# EAGLE schematic filter-prototype (EAGLE 8.6.0)
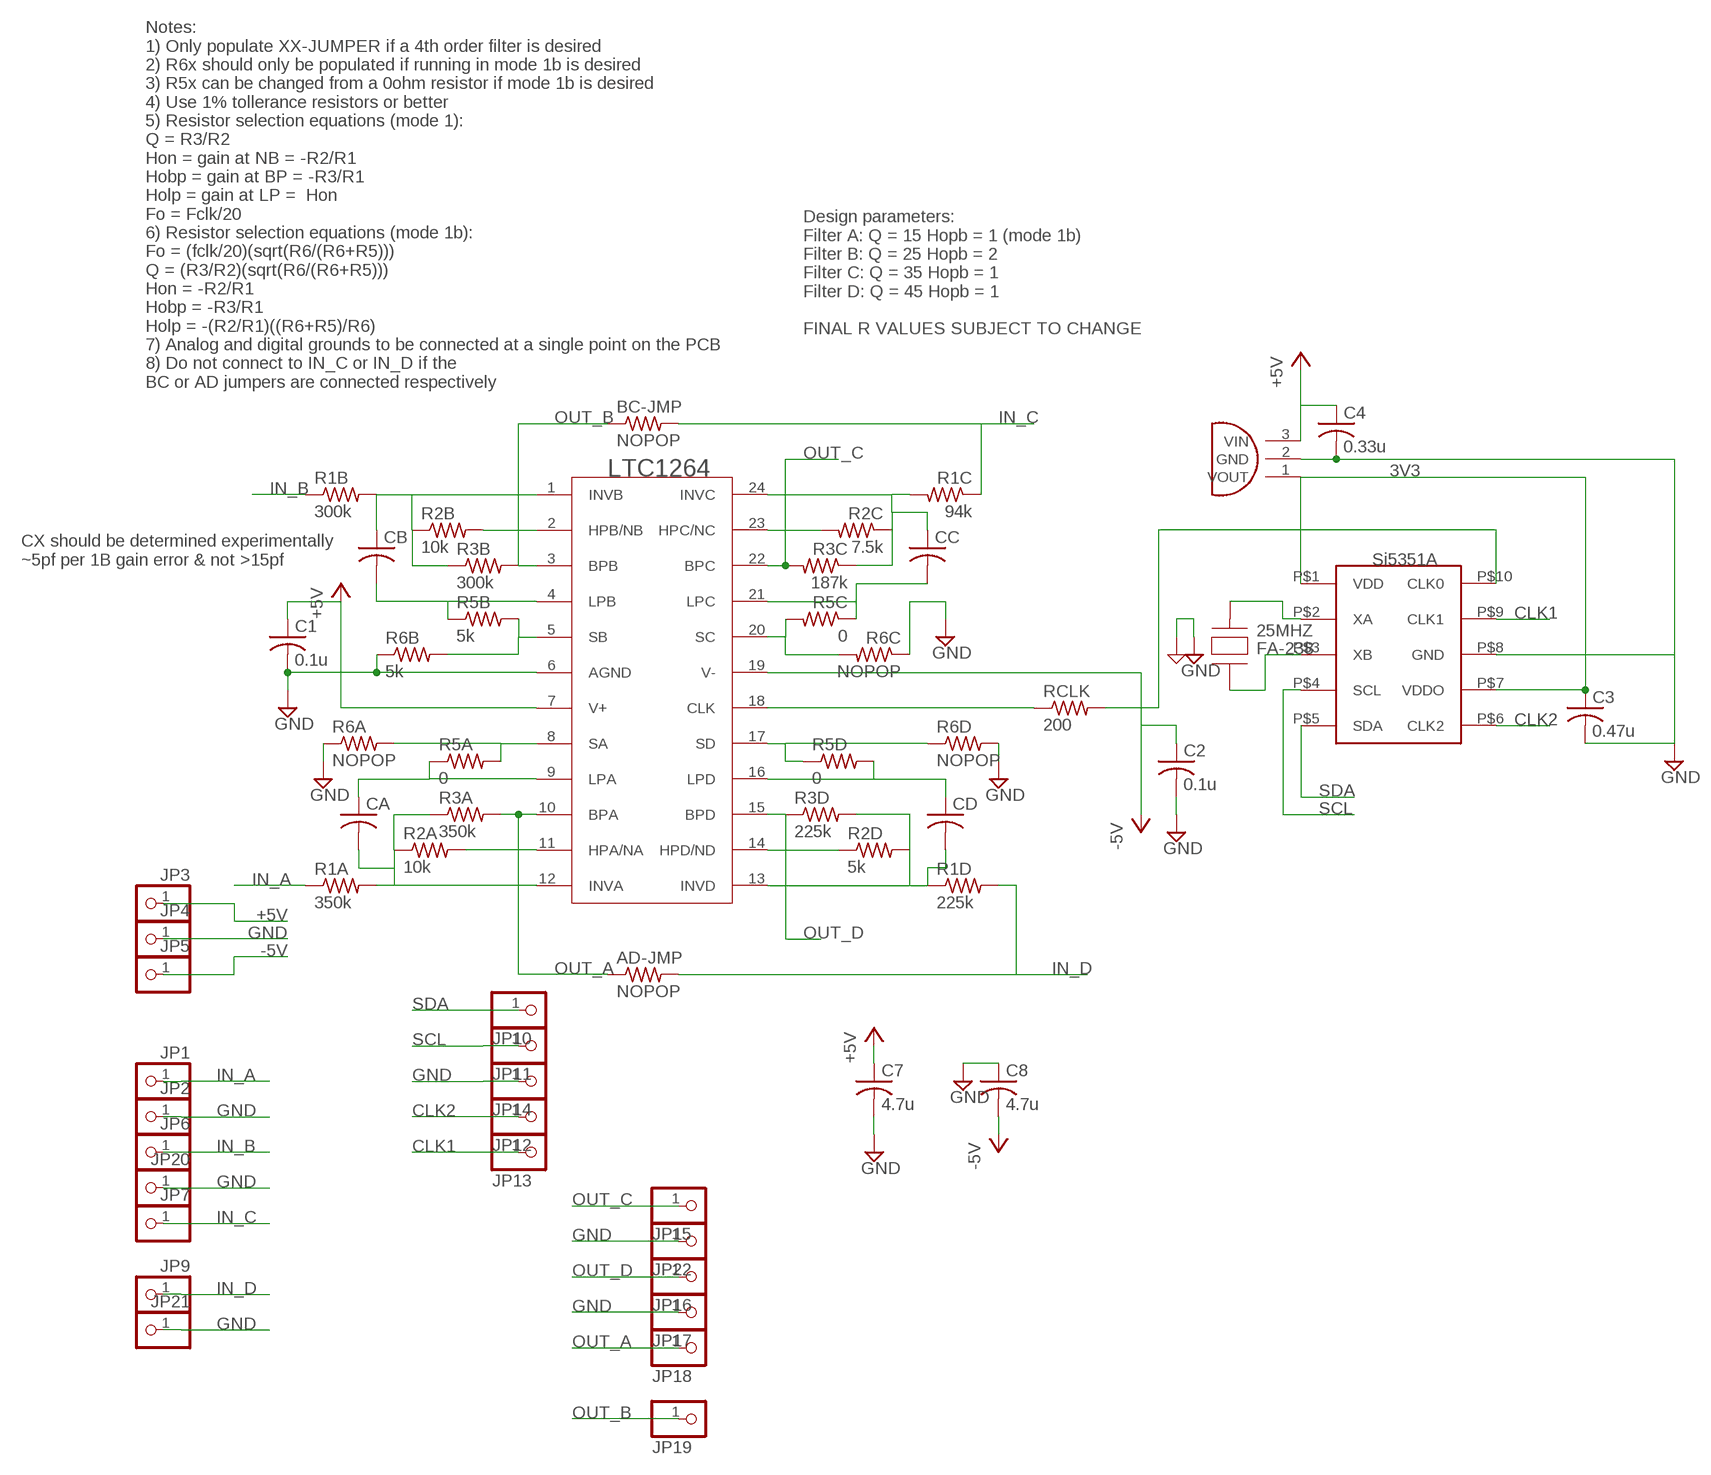
[diagram p0: schematic, sheet 1]

## Parts
25MHZ  FA-238  [FA-238]
AD-JMP  NOPOP  R-US_R0805  [R0805]
BC-JMP  NOPOP  R-US_R0805  [R0805]
C1  0.1u  C-USC0805  [C0805]
C2  0.1u  C-USC0805  [C0805]
C3  0.47u  C-USC0805  [C0805]
C4  0.33u  C-USC0805  [C0805]
C7  4.7u  C-USC0805  [C0805]
C8  4.7u  C-USC0805  [C0805]
CA  C-USC0805  [C0805]
CB  C-USC0805  [C0805]
CC  C-USC0805  [C0805]
CD  C-USC0805  [C0805]
JP1  PINHD-1X1  [1X01]
JP2  PINHD-1X1  [1X01]
JP3  PINHD-1X1  [1X01]
JP4  PINHD-1X1  [1X01]
JP5  PINHD-1X1  [1X01]
JP6  PINHD-1X1  [1X01]
JP7  PINHD-1X1  [1X01]
JP9  PINHD-1X1  [1X01]
JP10  PINHD-1X1  [1X01]
JP11  PINHD-1X1  [1X01]
JP12  PINHD-1X1  [1X01]
JP13  PINHD-1X1  [1X01]
JP14  PINHD-1X1  [1X01]
JP15  PINHD-1X1  [1X01]
JP16  PINHD-1X1  [1X01]
JP17  PINHD-1X1  [1X01]
JP18  PINHD-1X1  [1X01]
JP19  PINHD-1X1  [1X01]
JP20  PINHD-1X1  [1X01]
JP21  PINHD-1X1  [1X01]
JP22  PINHD-1X1  [1X01]
R1A  350k  R-US_R0805  [R0805]
R1B  300k  R-US_R0805  [R0805]
R1C  94k  R-US_R0805  [R0805]
R1D  225k  R-US_R0805  [R0805]
R2A  10k  R-US_R0805  [R0805]
R2B  10k  R-US_R0805  [R0805]
R2C  7.5k  R-US_R0805  [R0805]
R2D  5k  R-US_R0805  [R0805]
R3A  350k  R-US_R0805  [R0805]
R3B  300k  R-US_R0805  [R0805]
R3C  187k  R-US_R0805  [R0805]
R3D  225k  R-US_R0805  [R0805]
R5A  0  R-US_R0805  [R0805]
R5B  5k  R-US_R0805  [R0805]
R5C  0  R-US_R0805  [R0805]
R5D  0  R-US_R0805  [R0805]
R6A  NOPOP  R-US_R0805  [R0805]
R6B  5k  R-US_R0805  [R0805]
R6C  NOPOP  R-US_R0805  [R0805]
R6D  NOPOP  R-US_R0805  [R0805]
RCLK  200  R-US_R0805  [R0805]
U$1  LTC1264SMD  [SO24W]
U$2  SI5351A  [MSOP-10]
U$3  L78L33ACZ  [TO-92]

## Nets
3V3: C3.1 U$2.P$1(VDD) U$2.P$7(VDDO) U$3.1(VOUT)
+5V: C1.1 C4.1 C7.1 JP3.1 U$1.7(V+) U$3.3(VIN)
-5V: C2.1 C8.2 JP5.1 U$1.19(V-)
CLK1: JP13.1 U$2.P$9(CLK1)
CLK2: JP12.1 U$2.P$6(CLK2)
GND: 25MHZ.P$1(GND) 25MHZ.P$3(GND) C1.2 C2.2 C3.2 C4.2 C7.2 C8.1 JP2.1 JP4.1 JP14.1 JP17.1 JP20.1 JP21.1 JP22.1 R6A.1 R6B.1 R6C.1 R6D.2 U$1.6(AGND) U$2.P$8(GND) U$3.2(GND)
IN_A: JP1.1 R1A.1
IN_B: JP6.1 R1B.1
IN_C: BC-JMP.2 JP7.1 R1C.1
IN_D: AD-JMP.2 JP9.1 R1D.2
N$2: R2B.2 U$1.2(HPB/NB)
N$3: RCLK.2 U$2.P$10(CLK0)
N$4: R2C.2 U$1.23(HPC/NC)
N$7: CB.2 R5B.1 U$1.4(LPB)
N$8: R5B.2 R6B.2 U$1.5(SB)
N$12: CC.2 R5C.1 U$1.21(LPC)
N$13: R5C.2 R6C.2 U$1.20(SC)
N$16: R2A.2 U$1.11(HPA/NA)
N$18: CA.1 R5A.1 U$1.9(LPA)
N$19: R5A.2 R6A.2 U$1.8(SA)
N$20: CB.1 R1B.2 R2B.1 R3B.1 U$1.1(INVB)
N$21: CC.1 R1C.2 R2C.1 R3C.1 U$1.24(INVC)
N$22: R5D.1 R6D.1 U$1.17(SD)
N$23: CD.1 R5D.2 U$1.16(LPD)
N$25: R2D.1 U$1.14(HPD/ND)
N$26: CD.2 R1D.1 R2D.2 R3D.2 U$1.13(INVD)
N$27: 25MHZ.P$4(XA) U$2.P$2(XA)
N$28: 25MHZ.P$2(XB) U$2.P$3(XB)
N$31: RCLK.1 U$1.18(CLK)
N$32: CA.2 R1A.2 R2A.1 R3A.1 U$1.12(INVA)
OUT_A: AD-JMP.1 JP18.1 R3A.2 U$1.10(BPA)
OUT_B: BC-JMP.1 JP19.1 R3B.2 U$1.3(BPB)
OUT_C: JP15.1 R3C.2 U$1.22(BPC)
OUT_D: JP16.1 R3D.1 U$1.15(BPD)
SCL: JP11.1 U$2.P$4(SCL)
SDA: JP10.1 U$2.P$5(SDA)

## Notes on the sheet
- Design parameters:
  Filter A: Q = 15 Hopb = 1 (mode 1b)
  Filter B: Q = 25 Hopb = 2
  Filter C: Q = 35 Hopb = 1
  Filter D: Q = 45 Hopb = 1
  
  FINAL R VALUES SUBJECT TO CHANGE
- Notes: 
  1) Only populate XX-JUMPER if a 4th order filter is desired
  2) R6x should only be populated if running in mode 1b is desired
  3) R5x can be changed from a 0ohm resistor if mode 1b is desired
  4) Use 1% tollerance resistors or better
  5) Resistor selection equations (mode 1):
  Q = R3/R2
  Hon = gain at NB = -R2/R1
  Hobp = gain at BP = -R3/R1
  Holp = gain at LP =  Hon
  Fo = Fclk/20
  6) Resistor selection equations (mode 1b):
  Fo = (fclk/20)(sqrt(R6/(R6+R5)))
  Q = (R3/R2)(sqrt(R6/(R6+R5)))
  Hon = -R2/R1
  Hobp = -R3/R1
  Holp = -(R2/R1)((R6+R5)/R6)
  7) Analog and digital grounds to be connected at a single point on the PCB
  8) Do not connect to IN_C or IN_D if the 
  BC or AD jumpers are connected respectively
- CX should be determined experimentally
  ~5pf per 1B gain error & not >15pf

## Library data of the parts
25MHZ = ARVP:FA-238
AD-JMP BC-JMP R1A R1B R1C R1D R2A R2B R2C R2D R3A R3B R3C R3D R5A R5B R5C R5D R6A R6B R6C R6D RCLK = rcl:R-US_: RESISTOR, American symbol; SPICEPREFIX: R
C1-C4 C7 C8 CA CB CC CD = rcl:C-US: CAPACITOR, American symbol; SPICEPREFIX: C
JP1-JP7 JP9-JP22 = pinhead:PINHD-1X1: PIN HEADER
U$1 = ARVP:LTC1264
U$2 = ARVP:SI5351A
U$3 = ARVP:L78L33ACZ